# EAGLE schematic T-bar Breakout (EAGLE 6.2)
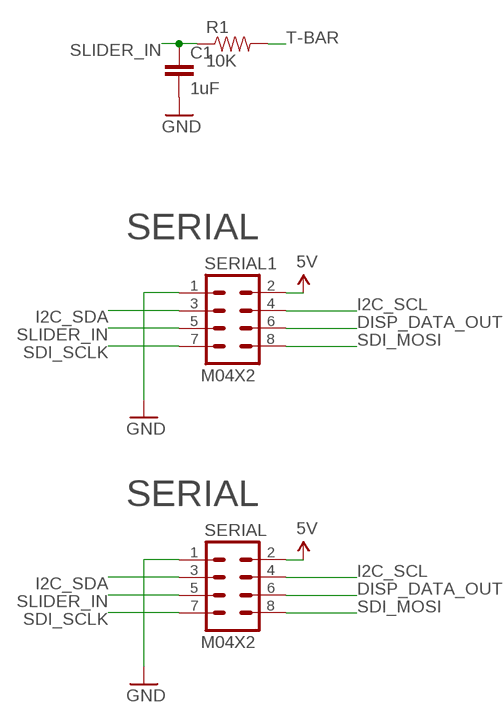
[diagram p0: schematic, sheet 1]

## Parts
C1  1uF  CAP0603-CAP  [0603-CAP]
R1  10K  RESISTOR0603-RES  [0603-RES]
SERIAL  M04X2  [2X4]
SERIAL1  M04X2  [2X4]

## Nets
5V [Power]: SERIAL1.2 SERIAL.2
DISP_DATA_OUT: SERIAL1.6 SERIAL.6
GND [Power]: C1.2 SERIAL1.1 SERIAL.1
I2C_SCL: SERIAL1.4 SERIAL.4
I2C_SDA: SERIAL1.3 SERIAL.3
SDI_MOSI: SERIAL1.8 SERIAL.8
SDI_SCLK: SERIAL1.7 SERIAL.7
SLIDER_IN: C1.1 R1.1 SERIAL1.5 SERIAL.5
T-BAR: R1.2

## Notes on the sheet
- SERIAL
- SERIAL

## Library data of the parts
C1 = SparkFun:CAP: Capacitor Standard 0603 ceramic capacitor, and 0.1" leaded capacitor.
R1 = SparkFun:RESISTOR: Resistor Basic schematic elements and footprints for 0603, 1206, and PTH resistors.
SERIAL SERIAL1 = SparkFun:M04X2

## Net classes
0 default: width 0.203 mm, drill 0.406 mm, clearance 0.203 mm
1 Power: width 0.406 mm, drill 0.61 mm, clearance 0.203 mm